# EAGLE design Controller (EAGLE 9.5.2)
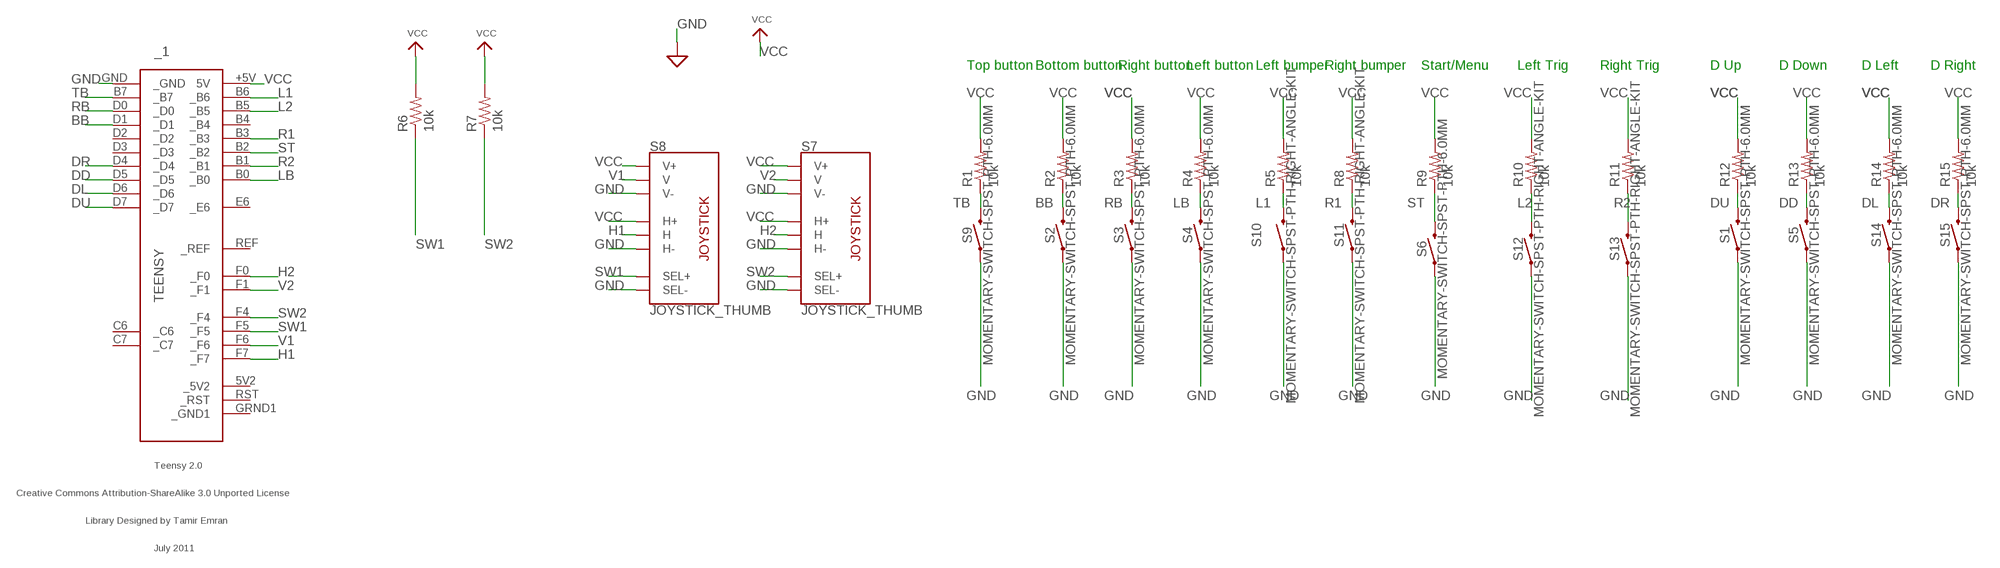
[diagram p0: schematic, sheet 1]

## Parts
_1  TEENSY  [TEENSY]
R1  10k  R-US_0207/10  [0207/10]
R2  10k  R-US_0207/10  [0207/10]
R3  10k  R-US_0207/10  [0207/10]
R4  10k  R-US_0207/10  [0207/10]
R5  10k  R-US_0207/10  [0207/10]
R6  10k  R-US_0207/10  [0207/10]
R7  10k  R-US_0207/10  [0207/10]
R8  10k  R-US_0207/10  [0207/10]
R9  10k  R-US_0207/10  [0207/10]
R10  10k  R-US_0207/10  [0207/10]
R11  10k  R-US_0207/10  [0207/10]
R12  10k  R-US_0207/10  [0207/10]
R13  10k  R-US_0207/10  [0207/10]
R14  10k  R-US_0207/10  [0207/10]
R15  10k  R-US_0207/10  [0207/10]
S1  MOMENTARY-SWITCH-SPST-PTH-6.0MM  [TACTILE_SWITCH_PTH_6.0MM]
S2  MOMENTARY-SWITCH-SPST-PTH-6.0MM  [TACTILE_SWITCH_PTH_6.0MM]
S3  MOMENTARY-SWITCH-SPST-PTH-6.0MM  [TACTILE_SWITCH_PTH_6.0MM]
S4  MOMENTARY-SWITCH-SPST-PTH-6.0MM  [TACTILE_SWITCH_PTH_6.0MM]
S5  MOMENTARY-SWITCH-SPST-PTH-6.0MM  [TACTILE_SWITCH_PTH_6.0MM]
S6  MOMENTARY-SWITCH-SPST-PTH-6.0MM  [TACTILE_SWITCH_PTH_6.0MM]
S7  JOYSTICK_THUMB  [JOYSTICK]
S8  JOYSTICK_THUMB  [JOYSTICK]
S9  MOMENTARY-SWITCH-SPST-PTH-6.0MM  [TACTILE_SWITCH_PTH_6.0MM]
S10  MOMENTARY-SWITCH-SPST-PTH-RIGHT-ANGLE-KIT  [TACTILE_SWITCH_PTH_RIGHT_ANGLE_KIT]
S11  MOMENTARY-SWITCH-SPST-PTH-RIGHT-ANGLE-KIT  [TACTILE_SWITCH_PTH_RIGHT_ANGLE_KIT]
S12  MOMENTARY-SWITCH-SPST-PTH-RIGHT-ANGLE-KIT  [TACTILE_SWITCH_PTH_RIGHT_ANGLE_KIT]
S13  MOMENTARY-SWITCH-SPST-PTH-RIGHT-ANGLE-KIT  [TACTILE_SWITCH_PTH_RIGHT_ANGLE_KIT]
S14  MOMENTARY-SWITCH-SPST-PTH-6.0MM  [TACTILE_SWITCH_PTH_6.0MM]
S15  MOMENTARY-SWITCH-SPST-PTH-6.0MM  [TACTILE_SWITCH_PTH_6.0MM]

## Nets
BB: _1.D1(_D1) R2.1 S2.3
DD: _1.D5(_D5) R13.1 S5.3
DL: _1.D6(_D6) R14.1 S14.3
DR: _1.D4(_D4) R15.1 S15.3
DU: _1.D7(_D7) R12.1 S1.3
GND: _1.GND(_GND) S1.1 S2.1 S3.1 S4.1 S5.1 S6.1 S7.B2A(SEL-) S7.H3(H-) S7.V3(V-) S8.B2A(SEL-) S8.H3(H-) S8.V3(V-) S9.1 S10.1 S11.1 S12.1 S13.1 S14.1 S15.1 ; supply symbol labelled SUP
H1: _1.F7(_F7) S8.H2(H)
H2: _1.F0(_F0) S7.H2(H)
L1: _1.B6(_B6) R5.1 S10.2
L2: _1.B5(_B5) R10.1 S12.2
LB: _1.B0(_B0) R4.1 S4.3
R1: _1.B3(_B3) R8.1 S11.2
R2: _1.B1(_B1) R11.1 S13.2
RB: _1.D0(_D0) R3.1 S3.3
ST: _1.B2(_B2) R9.1 S6.3
SW1: _1.F5(_F5) R6.1 S8.B1A(SEL+)
SW2: _1.F4(_F4) R7.1 S7.B1A(SEL+)
TB: _1.B7(_B7) R1.1 S9.3
V1: _1.F6(_F6) S8.V2(V)
V2: _1.F1(_F1) S7.V2(V)
VCC: _1.+5V(5V) R1.2 R2.2 R3.2 R4.2 R5.2 R6.2 R7.2 R8.2 R9.2 R10.2 R11.2 R12.2 R13.2 R14.2 R15.2 S7.H1(H+) S7.V1(V+) S8.H1(H+) S8.V1(V+)
Unconnected: _1.5V2(_5V2) _1.B4(_B4) _1.C6(_C6) _1.C7(_C7) _1.D2(_D2) _1.D3(_D3) _1.E6(_E6) _1.GRND1(_GND1) _1.REF(_REF) _1.RST(_RST)

## Notes on the sheet
- Top button | Bottom button | Right button | Left button | Left bumper | Right bumper | Start/Menu | Left Trig | Right Trig | D Up | D Down | D Left | D Right

## Library data of the parts
_1 = teensy:TEENSY: Teensy 2.0 Original Design by Clint Fisher Modified Design by Tamir Emran Licensed Under Creative Commons Attribution-ShareAlike 3.0 Unported (CC BY-SA 3.0)
R1-R15 = rcl:R-US_: RESISTOR, American symbol; SPICEPREFIX: R
S1-S6 S9 S14 S15 = SparkFun-Switches:MOMENTARY-SWITCH-SPST: Momentary Switch (Pushbutton) - SPST Normally-open (NO) SPST momentary switches (buttons, pushbuttons). Variants PTH-12MM - 12mm square, through-hole Momentary Pushbutton Switch - 12mm Square <https://www.sparkfun.com/products/9190> (COM-09190) PTH-6.0MM, PTH-6.0MM-KIT - 6.0mm square, through-hole Mini Pushbutton Switch <https://www.sparkfun.com/products/97> (COM-00097) KIT package intended for soldering kit's - only one side of pads' copper is exposed. PTH-RIGHT-ANGLE-KIT - Right-angle, through-hole Right Angle Tactile Button <https://www.sparkfun.com/products/10791> - Used on SparkFun BigTime Watch Kit <https://www.sparkfun.com/products/11734> SMD-12MM - 12mm square, surface-mount Tactile Button - SMD (12mm) <https://www.sparkfun.com/products/12993> (COM-12993) Used on SparkFun PicoBoard <https://www.sparkfun.com/products/11888> SMD-4.5MM - 4.5mm Square Trackball Switch Used on SparkFun Blackberry Trackballer Breakout <https://www.sparkfun.com/products/13169> SMD-4.6MMX2.8MM - 4.60mm x 2.80mm, surface mount Used on SparkFun SAMD21 Mini Breakout <https://www.sparkfun.com/products/13664> SMD-5.2MM, SMD-5.2-REDUNDANT - 5.2mm square, surface-mount Mini Pushbutton Switch - SMD <https://www.sparkfun.com/products/8720> (COM-08720) Used on Arduino Pro Mini <https://www.sparkfun.com/products/11114> REDUNDANT package connects both switch circuits together SMD-6.0X3.5MM - 6.0 x 3.5mm, surface mount Momentary Reset Switch SMD <https://www.sparkfun.com/products/8229> (COM-08229) SMD-6.2MM-TALL - 6.2mm square, surface mount Tactile Button - SMD (6mm) <https://www.sparkfun.com/products/12992> Used on SparkFun Digital Sandbox <https://www.sparkfun.com/products/12651> SMD-RIGHT-ANGLE - Right-angle, surface mount Used on SparkFun Block for Intel® Edison - Arduino <https://www.sparkfun.com/products/13036>; PROD_ID: SWCH-08441; SF_SKU: COM-00097
S7 S8 = SparkFun-Switches:JOYSTICK_THUMB: Analog Thumb Joystick This is a joystick very similar to the ‘analog’ joysticks on PS2 (PlayStation 2) controllers. Directional movements are simply two potentiometers - one for each axis. Pots are ~10k each. This joystick also has a select button that is actuated when the joystick is pressed down. SparkFun Products Thumb Joystick <https://www.sparkfun.com/products/9032> (COM-09032) SparkFun Thumb Joystick Breakout <https://www.sparkfun.com/products/9110> (BOB-09110) SparkFun Joystick Shield Kit <https://www.sparkfun.com/products/9760> (DEV-09760); PROD_ID: COMP-09744; SF_SKU: COM-09032
S10-S13 = SparkFun-Switches:MOMENTARY-SWITCH-SPST: Momentary Switch (Pushbutton) - SPST Normally-open (NO) SPST momentary switches (buttons, pushbuttons). Variants PTH-12MM - 12mm square, through-hole Momentary Pushbutton Switch - 12mm Square <https://www.sparkfun.com/products/9190> (COM-09190) PTH-6.0MM, PTH-6.0MM-KIT - 6.0mm square, through-hole Mini Pushbutton Switch <https://www.sparkfun.com/products/97> (COM-00097) KIT package intended for soldering kit's - only one side of pads' copper is exposed. PTH-RIGHT-ANGLE-KIT - Right-angle, through-hole Right Angle Tactile Button <https://www.sparkfun.com/products/10791> - Used on SparkFun BigTime Watch Kit <https://www.sparkfun.com/products/11734> SMD-12MM - 12mm square, surface-mount Tactile Button - SMD (12mm) <https://www.sparkfun.com/products/12993> (COM-12993) Used on SparkFun PicoBoard <https://www.sparkfun.com/products/11888> SMD-4.5MM - 4.5mm Square Trackball Switch Used on SparkFun Blackberry Trackballer Breakout <https://www.sparkfun.com/products/13169> SMD-4.6MMX2.8MM - 4.60mm x 2.80mm, surface mount Used on SparkFun SAMD21 Mini Breakout <https://www.sparkfun.com/products/13664> SMD-5.2MM, SMD-5.2-REDUNDANT - 5.2mm square, surface-mount Mini Pushbutton Switch - SMD <https://www.sparkfun.com/products/8720> (COM-08720) Used on Arduino Pro Mini <https://www.sparkfun.com/products/11114> REDUNDANT package connects both switch circuits together SMD-6.0X3.5MM - 6.0 x 3.5mm, surface mount Momentary Reset Switch SMD <https://www.sparkfun.com/products/8229> (COM-08229) SMD-6.2MM-TALL - 6.2mm square, surface mount Tactile Button - SMD (6mm) <https://www.sparkfun.com/products/12992> Used on SparkFun Digital Sandbox <https://www.sparkfun.com/products/12651> SMD-RIGHT-ANGLE - Right-angle, surface mount Used on SparkFun Block for Intel® Edison - Arduino <https://www.sparkfun.com/products/13036>; PROD_ID: CONN-10672; SF_SKU: COM-10791

## Board
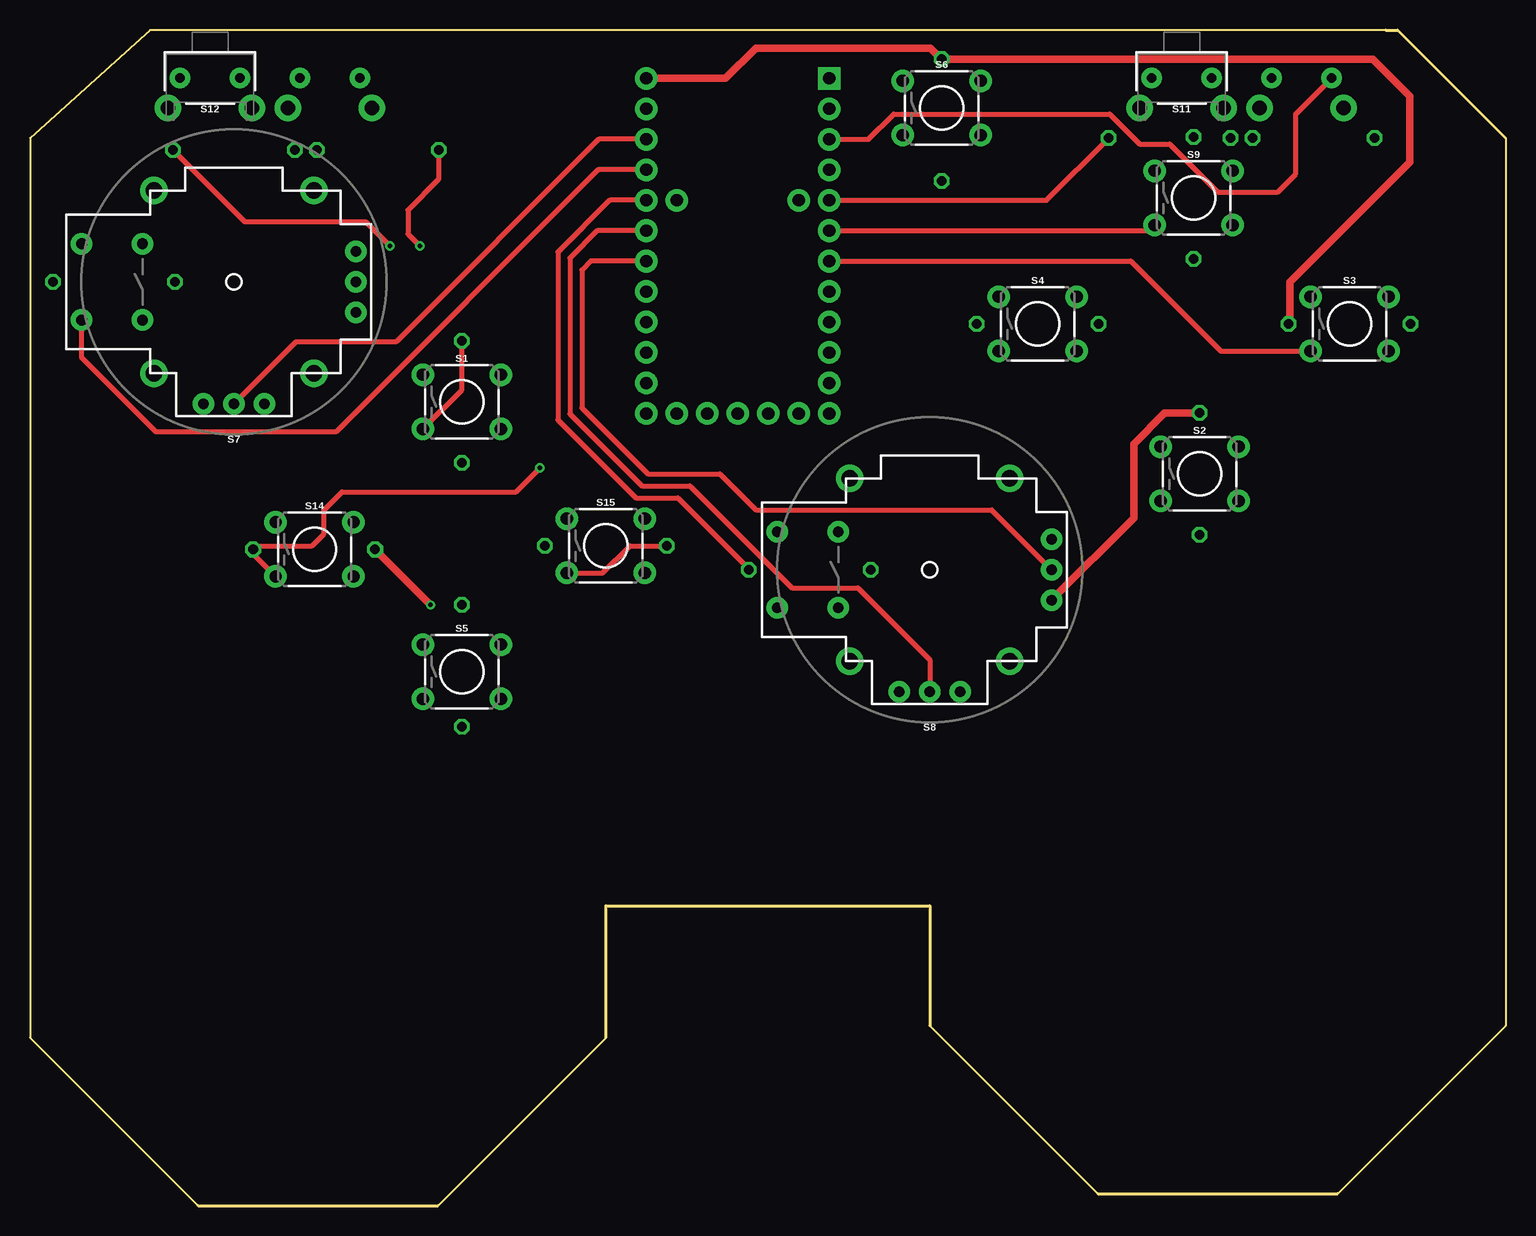
[diagram p1: board, top side]
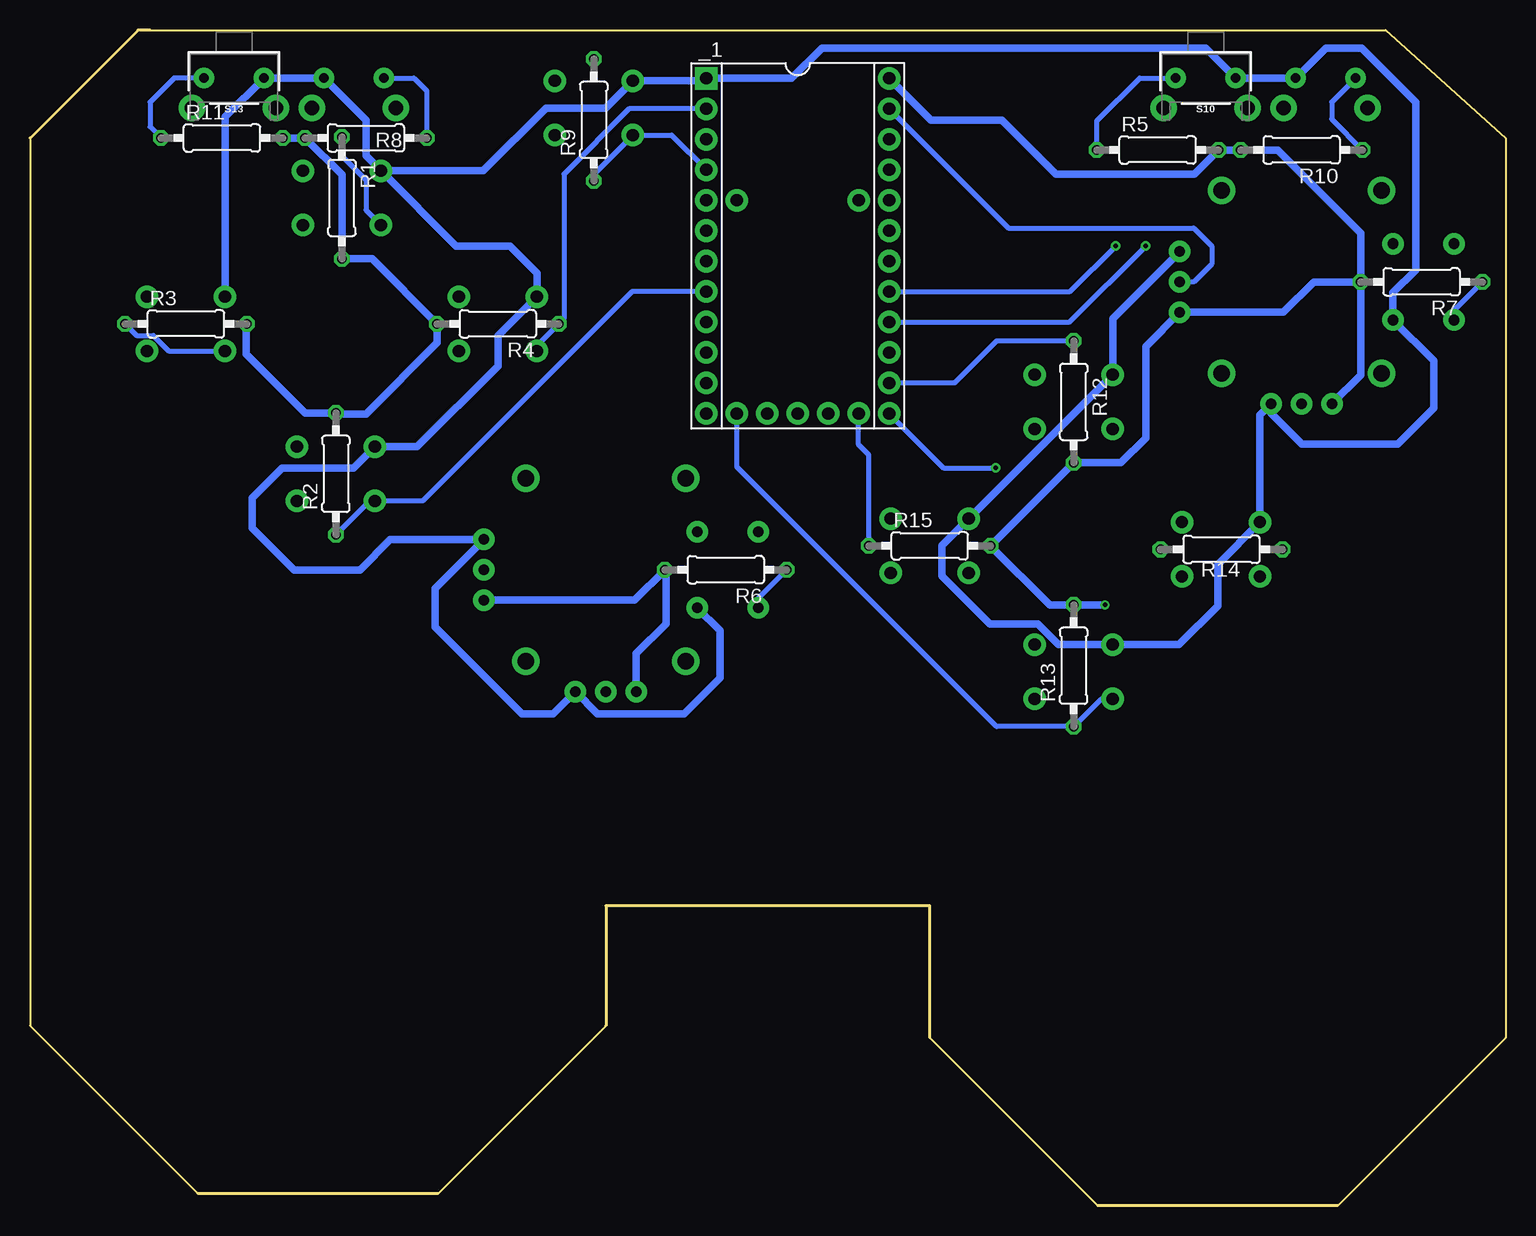
[diagram p2: board, bottom side, seen from below]

Size 123 x 98 mm. Coordinates in mm from the lower left corner, seen from the top.
Outline: 113,98 10,98 0,89 0,14 14,0 34,0 48,14 48,25 75,25 75,15 89,1 109,1 123,15 123,89 114,98 113,98
Copper layers (1*16): Top 0.035mm / dielectric 1.5mm / Bottom 0.035mm
Design rules "default": minimum track width 6mil, minimum drill 0.35mm, track to track 6mil, track to pad 6mil, pad to pad 6mil, via to via 6mil, smd to smd 6mil, copper to edge 40mil, drill to drill 6mil, minimum pad ring 10mil, minimum via ring 8mil, stop-mask expansion 4mil, vias tented up to drill 0mil, thermal gap 10mil

### Footprints (pad centres in the part's own frame; a part is rotated, then mirrored left to right if it is on the bottom)
TEENSY = drill 1.016 pad 1.88: 5V2 13.97,-2.54; +5V -13.97,7.62; B0 -11.43,-7.62; B1 -8.89,-7.62; B2 -6.35,-7.62; B3 -3.81,-7.62; B4 8.89,7.62; B5 6.35,7.62; B6 3.81,7.62; B7 -1.27,-7.62; C6 11.43,-7.62; C7 13.97,-7.62; D0 1.27,-7.62; D1 3.81,-7.62; D2 6.35,-7.62; D3 8.89,-7.62; D4 13.97,5.08; D5 13.97,-5.08; D6 13.97,7.62; D7 11.43,7.62; E6 -3.81,-5.08; F0 -11.43,7.62; F1 -8.89,7.62; F4 -6.35,7.62; F5 -3.81,7.62; F6 -1.27,7.62; F7 1.27,7.62; GRND1 13.97,0; REF -3.81,5.08; RST 13.97,2.54 | drill 1.016 pad 1.88 square: GND -13.97,-7.62
0207/10 = drill 0.813 octagon: 1 -5.08,0; 2 5.08,0
TACTILE_SWITCH_PTH_6.0MM = drill 1.016 pad 1.88: 1 -3.251,2.261; 2 3.251,2.261; 3 -3.251,-2.261; 4 3.251,-2.261
JOYSTICK = drill 0.9 pad 1.778: B1A -3.175,12.7; B1B 3.175,12.7; B2A -3.175,7.62; B2B 3.175,7.62 | drill 0.889 pad 1.778: H1 -2.54,-10.16; H2 0,-10.16; H3 2.54,-10.16; V1 -10.16,2.54; V2 -10.16,0; V3 -10.16,-2.54 | drill 1.397 pad 2.286: MOUNT1 -7.62,6.668; MOUNT2 -7.62,-6.668; MOUNT3 7.62,-6.668; MOUNT4 7.62,6.668
TACTILE_SWITCH_PTH_RIGHT_ANGLE_KIT = drill 0.8 pad 1.7: 1 -2.5,0; 2 2.5,0 | drill 1.2 pad 2.2: ANCHOR1 -3.5,2.5; ANCHOR2 3.5,2.5

### Placement (x,y rotation side)
_1  59,80 270 bottom
R1  97,84 270 bottom
R2  97.5,61 90 bottom
R3  110,73.5 0 bottom
R4  84,73.5 180 bottom
R5  29,88 0 bottom
R6  65,53 180 bottom
R7  7,77 180 bottom
R8  95,89 180 bottom
R9  76,90.5 90 bottom
R10  17,88 180 bottom
R11  107,89 0 bottom
R12  36,67 270 bottom
R13  36,45 90 bottom
R14  23.68,54.7 180 bottom
R15  48,55 0 bottom
S1  36,67 0 top
S2  97.5,61 0 top
S3  110,73.5 0 top
S4  84,73.5 0 top
S5  36,44.5 0 top
S6  76,91.5 0 top
S7  17,77 90 top
S8  75,53 90 top
S9  97,84 0 top
S10  25,94 180 bottom
S11  96,94 180 top
S12  15,94 180 top
S13  106,94 180 bottom
S14  23.72,54.71 0 top
S15  48,55 0 top

### Tracks (layer width: path | path; a pad name or v marks a point on that pad's centre or on a via)
BB
  Bottom 0.406: _1.D1 72.81,76.19 90.26,58.74 S2.3 94.68,58.74 R2.1
DD
  Bottom 0.406: S5.3 33.68,42.24 R13.1 42.42,39.92 64.08,61.58 _1.D5
DL  (via drill 0.35)
  Top 0.406: S14.3 18.6,54.32 R14.1 18.9,55 23.5,55 24.5,56 24.5,58 26,59.5 40.5,59.5 v42.5,61.5
  Bottom 0.406: _1.D6 46.85,61.5 v42.5,61.5
DR
  Top 0.406: S15.3 47.74,52.74 50,55 R15.1
  Bottom 0.406: R15.1 53.08,62.58 53.92,63.42 _1.D4
DU
  Top 0.406: S1.3 36,67.99 R12.1
  Bottom 0.406: R12.1 42.42,72.08 45.93,68.57 _1.D7
GND
  Bottom 0.61: S9.1 95,87.51 95,90.5 S11.1 S13.1 106.75,90.75 S3.1 | S8.B2A 65.5,47.95 65.5,44 68.5,41 75.7,41 S8.V3 79.38,41 82,41 89.25,48.25 89.25,51.45 S8.H3 92.96,55.54 95.5,53 101,53 104.5,56.5 104.5,59 102,61.5 96.01,61.5 S2.1 90.74,63.26 84,70 84,72.51 S4.1 80.75,77.75 83,80 87.49,80 S9.1 | S7.H3 32.75,73.95 S1.1 S15.1 47,55.01 47,52.5 43,48.5 39,48.5 37.26,46.76 S5.1 27.24,46.76 24,50 24,53.44 S14.1 20.47,65.91 S7.V3 19.54,66.04 17,63.5 9,63.5 6,66.5 6,70.44 S7.B2A 9.38,76.12 7.5,78 7.5,92 12,96.5 15,96.5 S12.1 S10.1 25,96.5 57,96.5 59.53,93.97 _1.GND 66.83,93.76 S6.1 75.01,91.5 80,91.5 85.24,86.26 S9.1
H1
  Top 0.406: _1.F7 46.73,78.73 46,78 46,66.5 51.5,61 57.5,61 60.5,58 80.16,58 S8.H2
H2
  Bottom 0.406: _1.F0 41.45,81.5 26,81.5 24.5,80 24.5,78.5 26,77 S7.H2
L1  (via drill 0.35)
  Top 0.406: R5.1 34.08,85.58 31.5,83 31.5,81 v32.5,80
  Bottom 0.406: _1.B6 36.31,76.19 v32.5,80 | R5.1 34.08,90.42 30.5,94 S10.2
L2  (via drill 0.35)
  Top 0.406: v30,80 28,82 17.92,82 R10.1
  Bottom 0.406: S12.2 14.5,92 14.5,90.58 R10.1 | _1.B5 36.35,73.65 v30,80
LB
  Bottom 0.406: _1.B0 73.07,91.43 78.5,86 78.5,73.92 R4.1 80.75,71.67 S4.3
R1
  Top 0.406: _1.B3 84.73,83.81 R8.1
  Bottom 0.406: S11.2 91,94 89.92,92.92 R8.1
R2
  Top 0.406: _1.B1 69.89,88.89 72,91 90,91 92.5,88.5 95,88.5 99,84.5 104,84.5 105.5,86 105.5,91 S13.2
  Bottom 0.406: S13.2 111,94 113,92 113,89.92 R11.1
RB
  Top 0.406: _1.D0 91.77,78.73 97.25,73.25 99.26,71.24 S3.3
  Bottom 0.406: R3.1 114.12,72.53 112.72,72.53 111.42,71.24 S3.3
ST
  Bottom 0.406: R9.1 76,85.99 S6.3 69.51,89.24 _1.B2
SW1
  Top 0.406: _1.F5 48.31,83.81 44,79.5 44,65.5 50.5,59 54,59 59.92,53.08 R6.1
  Bottom 0.406: R6.1 62.3,50.62 S8.B1A
SW2
  Top 0.406: _1.F4 47.35,86.35 25.5,64.5 10.5,64.5 4.3,70.7 S7.B1A
  Bottom 0.406: R7.1 4.3,74.62 S7.B1A
TB
  Top 0.406: _1.B7 93.28,81.27 S9.3
  Bottom 0.406: R1.1 97,87.5 95,85.5 95,82.99 S9.3
V1
  Top 0.406: _1.F6 47.27,81.27 45,79 45,66 51,60 55,60 63.5,51.5 69,51.5 75,45.5 S8.V2
V2
  Top 0.406: _1.F1 47.39,88.89 30.5,72 22.16,72 S7.V2
VCC  (via drill 0.35)
  Top 0.61: _1.+5V 57.97,93.97 60.5,96.5 75.08,96.5 R9.2 111.92,95.58 115,92.5 115,87 105,77 105,73.58 R3.2 | R2.2 94.58,66.08 92,63.5 92,57.3 S8.H1 | R14.2 v33.38,50.08
  Bottom 0.61: R11.2 R8.2 97,85.92 R1.2 94.5,78.92 R4.2 89.08,71.92 95,66 97.42,66 R2.2 100.08,66.08 105,71 105,73.42 R3.2 | S8.H1 72.62,50.46 R6.2 70,52.92 70,48.5 72.46,46.04 S8.V1 | R7.2 12.08,81.08 19,88 R10.2 R5.2 25.92,86 37.5,86 42,90.5 47.91,90.5 _1.+5V | v33.38,50.08 R13.2 38,50.08 R15.2 R12.2 32.08,61.92 30,64 30,71.62 S7.H1 18.54,74.46 16,77 R7.2 | R7.2 12.08,69.22 S7.V1